# EAGLE schematic stable_grid_schmitt_trigger (EAGLE 7.3.0)
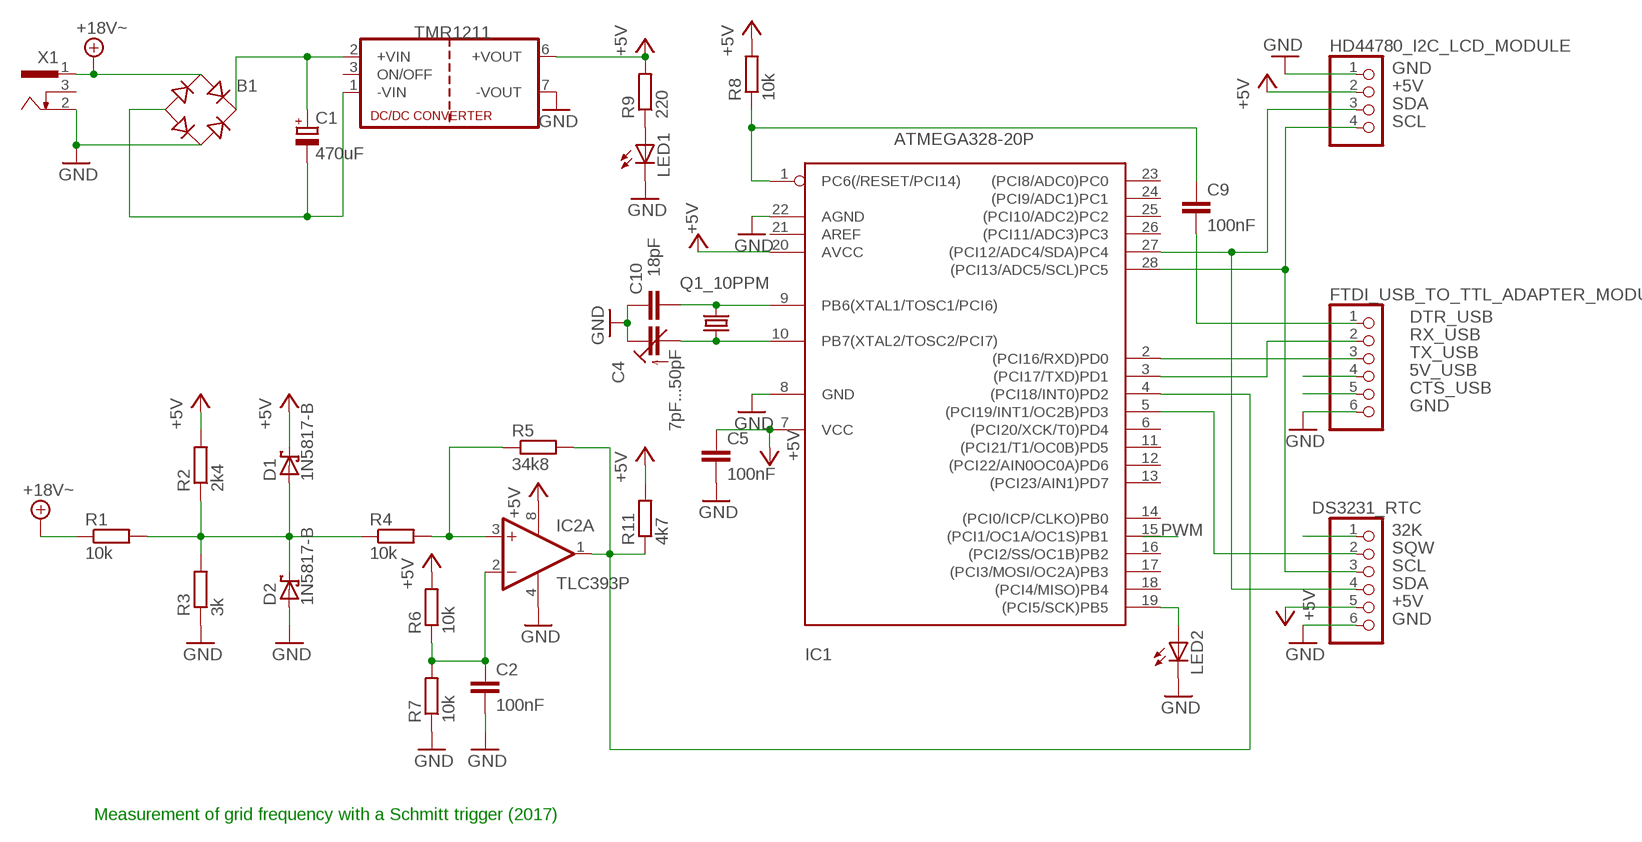
[diagram p0: schematic, sheet 1]

## Parts
B1  B-DIL  [B-DIL]
C1  470uF  CPOL-EU085CS-1AR  [085CS_1AR]
C2  100nF  C-EU025-024X044  [C025-024X044]
C4  7pF...50pF  C-TRIMM808  [CTRIM808-BC]
C5  100nF  C-EU025-024X044  [C025-024X044]
C9  100nF  C-EU025-024X044  [C025-024X044]
C10  18pF  C-EU025-024X044  [C025-024X044]
D1  1N5817-B  [DO41-7.6]
D2  1N5817-B  [DO41-7.6]
DS3231_RTC  PINHD-1X6  [1X06]
FTDI_USB_TO_TTL_ADAPTER_MODULE  PINHD-1X6  [1X06]
HD44780_I2C_LCD_MODULE  PINHD-1X4  [1X04]
IC1  ATMEGA328-20P  [DIL28-3]
IC2  TLC393P  [DIL08]
LED1  LAP4-BOTTOM  [P47F-BOTTOM]
LED2  LAP4-BOTTOM  [P47F-BOTTOM]
Q1_10PPM  CRYSTALHC49S  [HC49/S]
R1  10k  R-EU_M0805  [M0805]
R2  2k4  R-EU_M0805  [M0805]
R3  3k  R-EU_M0805  [M0805]
R4  10k  R-EU_M0805  [M0805]
R5  34k8  R-EU_M0805  [M0805]
R6  10k  R-EU_M0805  [M0805]
R7  10k  R-EU_M0805  [M0805]
R8  10k  R-EU_M0805  [M0805]
R9  220  R-EU_M0805  [M0805]
R11  4k7  R-EU_M0805  [M0805]
SPS1  TMR1211  [TRACO_SIP-8]
X1  733980-62  [733980-62]

## Nets
5V_USB: FTDI_USB_TO_TTL_ADAPTER_MODULE.4
32K: DS3231_RTC.1
+5V: C5.1 D1.C DS3231_RTC.5 HD44780_I2C_LCD_MODULE.2 IC1.7(VCC) IC1.20(AVCC) IC2.8(P:V+) R2.2 R6.2 R8.2 R9.2 R11.2 SPS1.6(+VOUT)
+18V: B1.AC1 R1.1 X1.1 ; supply symbol labelled +18V~
CTS_USB: FTDI_USB_TO_TTL_ADAPTER_MODULE.5
DTR_USB: C9.2 FTDI_USB_TO_TTL_ADAPTER_MODULE.1
GND: B1.AC2 C2.2 C4.1(E) C5.2 C10.1 D2.A DS3231_RTC.6 FTDI_USB_TO_TTL_ADAPTER_MODULE.6 HD44780_I2C_LCD_MODULE.1 IC1.8(GND) IC1.22(AGND) IC2.4(P:V-) LED1.C LED2.C R3.1 R7.1 SPS1.7(-VOUT) X1.2
N$1: B1.+ C1.+ SPS1.2(+VIN)
N$2: IC2.3(A:+IN) R4.2 R5.1
N$3: D1.A D2.C R1.2 R2.1 R3.2 R4.1
N$4: C10.2 IC1.9(PB6(XTAL1/TOSC1/PCI6)) Q1_10PPM.2
N$5: C2.1 IC2.2(A:-IN) R6.1 R7.2
N$6: IC1.19((PCI5/SCK)PB5) LED2.A
N$7: LED1.A R9.1
N$8: C4.2(A) IC1.10(PB7(XTAL2/TOSC2/PCI7)) Q1_10PPM.1
N$9: IC1.4((PCI18/INT0)PD2) IC2.1(A:OUT) R5.2 R11.1
N$10: C9.1 IC1.1(PC6(/RESET/PCI14)) R8.1
N$11: B1.- C1.- SPS1.1(-VIN)
RX_USB: FTDI_USB_TO_TTL_ADAPTER_MODULE.2 IC1.3((PCI17/TXD)PD1)
SCL: DS3231_RTC.3 HD44780_I2C_LCD_MODULE.4 IC1.28((PCI13/ADC5/SCL)PC5)
SDA: DS3231_RTC.4 HD44780_I2C_LCD_MODULE.3 IC1.27((PCI12/ADC4/SDA)PC4)
SQW: DS3231_RTC.2 IC1.5((PCI19/INT1/OC2B)PD3)
TX_USB: FTDI_USB_TO_TTL_ADAPTER_MODULE.3 IC1.2((PCI16/RXD)PD0)
Unconnected: IC1.6((PCI20/XCK/T0)PD4) IC1.11((PCI21/T1/OC0B)PD5) IC1.12((PCI22/AIN0OC0A)PD6) IC1.13((PCI23/AIN1)PD7) IC1.14((PCI0/ICP/CLKO)PB0) IC1.15((PCI1/OC1A/OC1S)PB1) IC1.16((PCI2/SS/OC1B)PB2) IC1.17((PCI3/MOSI/OC2A)PB3) IC1.18((PCI4/MISO)PB4) IC1.21(AREF) IC1.23((PCI8/ADC0)PC0) IC1.24((PCI9/ADC1)PC1) IC1.25((PCI10/ADC2)PC2) IC1.26((PCI11/ADC3)PC3) IC2.5(B:+IN) IC2.6(B:-IN) IC2.7(B:OUT) SPS1.3(ON/OFF) X1.3

## Notes on the sheet
- Measurement of grid frequency with a Schmitt trigger (2017)

## Library data of the parts
B1 = rectifier:B-DIL: RECTIFIER
C1 = rcl:CPOL-EU: POLARIZED CAPACITOR, European symbol
C2 C5 C9 C10 = rcl:C-EU: CAPACITOR, European symbol
C4 = rcl:C-TRIMM: Trimm capacitor
D1 D2 = diode:1N581*: 1.0A SCHOTTKY BARRIER RECTIFIER Source: http://www.diodes.com/datasheets/ds23001.pdf
DS3231_RTC FTDI_USB_TO_TTL_ADAPTER_MODULE = pinhead:PINHD-1X6: PIN HEADER
HD44780_I2C_LCD_MODULE = pinhead:PINHD-1X4: PIN HEADER
IC1 = atmega328:ATMEGA328*P: MICROCONTROLLER 32 kBytes FLASH 2 kBytes SRAM 1 kBytes EEPROM USART 8-channel 10 bit ADC
IC2 = linear:TLC393: COMPARATOR
LED1 LED2 = led:*P4: PointLED® Enhanced Thinfilm LED TOP & BOTTOM mount LS P47F, LR P47F, LA P47F, LY P47F, LT P4SG, LB P4SG, LW P4SG Source: http://catalog.osram-os.com .. LA_LR_LS_LY_P47F_Pb_free.pdf
Q1_10PPM = crystal:CRYSTAL: CRYSTAL; OC_FARNELL: 1667008; OC_NEWARK: unknown
R1-R9 R11 = rcl:R-EU_: RESISTOR, European symbol
SPS1 = my_mixed:TMR1211
X1 = con-conrad:73398?: FEMALE PRINT CONNECTOR Niedervolt-Steckverbinder Distributor Conrad